# EAGLE design 1001-B Clone (EAGLE 6.3)
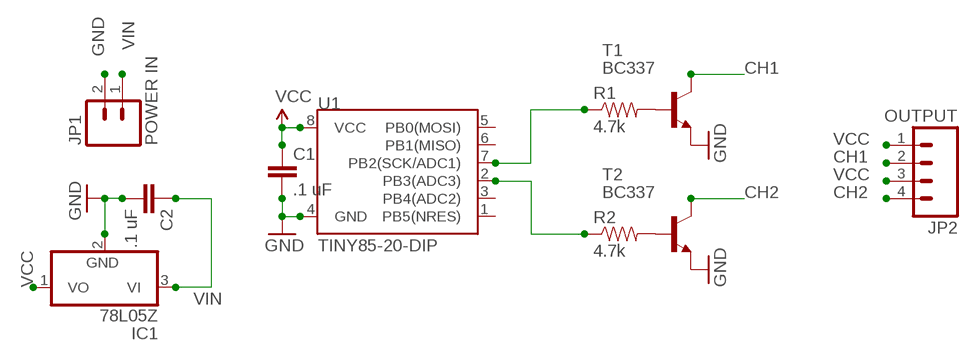
[diagram p0: schematic, sheet 1]

## Parts
C1  .1 uF  CAP1206  [1206]
C2  .1 uF  CAP1206  [1206]
IC1  78L05Z  [TO92]
JP1  POWER IN  M023.5MM  [SCREWTERMINAL-3.5MM-2]
JP2  OUTPUT  M04SCREW  [SCREWTERMINAL-3.5MM-4]
R1  4.7k  RESISTOR1206  [1206]
R2  4.7k  RESISTOR1206  [1206]
T1  BC337  [TO92]
T2  BC337  [TO92]
U1  TINY85-20-DIP  ATTINY45TINY85-20-DIP  [DIP08]

## Nets
CH1: JP2.2 T1.3(C)
CH2: JP2.4 T2.3(C)
GND: C1.2 C2.2 IC1.2(GND) JP1.2 T1.1(E) T2.1(E) U1.4(GND)
N$3: R1.2 T1.2(B)
N$4: R2.2 T2.2(B)
N$5: R1.1 U1.7(PB2(SCK/ADC1))
N$6: R2.1 U1.2(PB3(ADC3))
VCC: C1.1 IC1.1(VO) JP2.1 JP2.3 U1.8(VCC)
VIN: C2.1 IC1.3(VI) JP1.1
Unconnected: U1.1(PB5(NRES)) U1.3(PB4(ADC2)) U1.5(PB0(MOSI)) U1.6(PB1(MISO))

## Library data of the parts
C1 C2 = SparkFun-Capacitors:CAP: Capacitor Standard 0603 ceramic capacitor, and 0.1" leaded capacitor.
IC1 = linear:78*: Positive VOLTAGE REGULATOR Source: http://cache.national.com/ds/LM/LM78L05.pdf http://www.fairchildsemi.com/ds/LM/LM7805.pdf
JP1 = SparkFun-Connectors:M02: Header 2 Standard 2-pin 0.1" header. Use with straight break away headers (SKU : PRT-00116), right angle break away headers (PRT-00553), swiss pins (PRT-00743), machine pins (PRT-00117), and female headers (PRT-00115). Molex polarized connector foot print use with SKU : PRT-08233 with associated crimp pins and housings.
JP2 = SparkFun-Connectors:M04: Header 4 Standard 4-pin 0.1" header. Use with straight break away headers (SKU : PRT-00116), right angle break away headers (PRT-00553), swiss pins (PRT-00743), machine pins (PRT-00117), and female headers (PRT-00115). Molex polarized connector foot print use with SKU : PRT-08231 with associated crimp pins and housings. 1MM SMD Version SKU: PRT-10208
R1 R2 = SparkFun-Resistors:RESISTOR: Resistor Basic schematic elements and footprints for 0603, 1206, and PTH resistors.
T1 T2 = transistor:BC337: NPN TRANSISTOR
U1 = SparkFun-DigitalIC:ATTINY45: Atmel 8-pin 2/4/8kB flash uC; PROD_ID: IC-09445

## Board
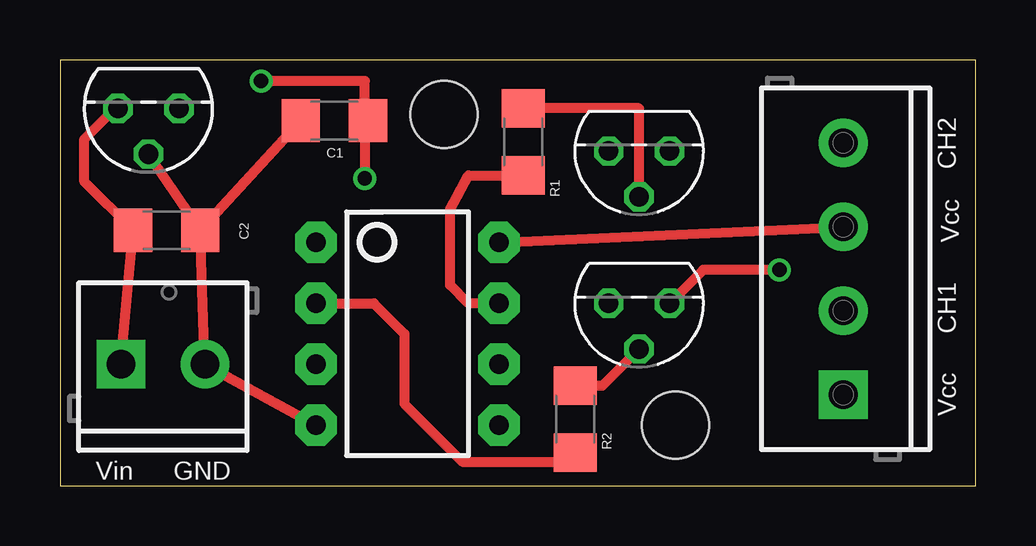
[diagram p1: board, top side]
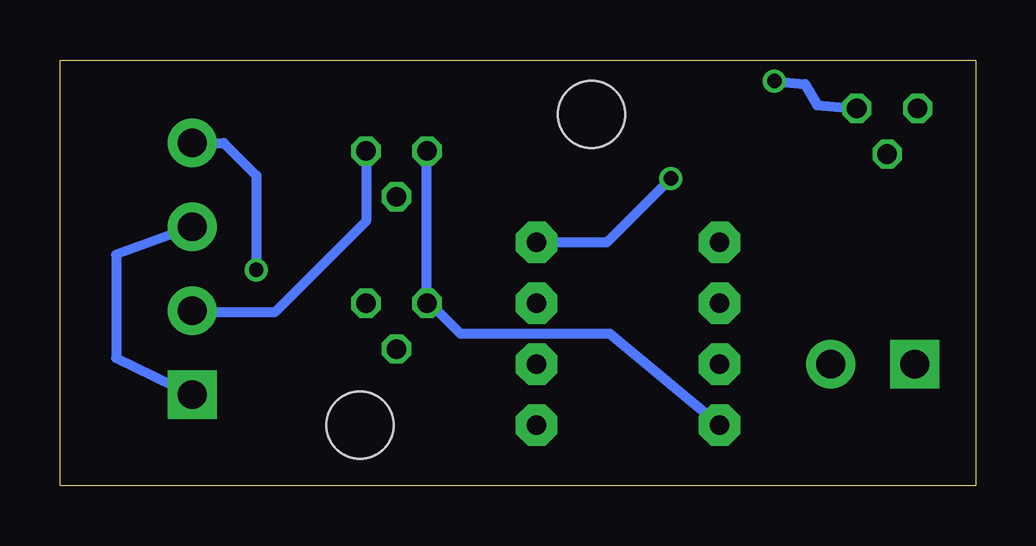
[diagram p2: board, bottom side, seen from below]

Size 38.15 x 17.77 mm. Coordinates in mm from the lower left corner, seen from the top.
Outline: 0,0 38.15,0 38.15,17.77 0,17.77 0,0
Copper layers (1*16): Top 0.0356mm / dielectric 1.5011mm / Bottom 0.0356mm
Design rules "LaenPCBOrder": minimum track width 6mil, minimum drill 13mil, track to track 6mil, track to pad 6mil, pad to pad 6mil, via to via 6mil, smd to smd 6mil, copper to edge 15mil, drill to drill 6mil, minimum pad ring 7mil, minimum via ring 7mil, stop-mask expansion 4mil, vias tented up to drill 0mil, thermal gap 10mil
Holes 2.8 mm at 16,15.49 25.65,2.54

### Footprints (pad centres in the part's own frame; a part is rotated, then mirrored left to right if it is on the bottom)
1206 = smd 1.6 x 1.8: 1 -1.4,0; 2 1.4,0
TO92 = drill 0.813 octagon: 1 -1.27,0; 2 0,1.905; 3 1.27,0
SCREWTERMINAL-3.5MM-2 = drill 1.2 pad 2.032 square: 1 0,0 | drill 1.2 pad 2.032: 2 3.5,0
SCREWTERMINAL-3.5MM-4 = drill 1.2 pad 2.032 square: 1 0,0 | drill 1.2 pad 2.032: 2 3.5,0; 3 7,0; 4 10.5,0
TO92' = drill 0.813 octagon: 1 1.27,0; 2 0,1.905; 3 -1.27,0
DIP08 = drill 0.813 pad 1.727 octagon: 1 -3.81,-3.81; 2 -1.27,-3.81; 3 1.27,-3.81; 4 3.81,-3.81; 5 3.81,3.81; 6 1.27,3.81; 7 -1.27,3.81; 8 -3.81,3.81

### Placement (x,y rotation side)
C1  11.43,15.24 180 top
C2  4.45,10.67 0 top
IC1  3.68,15.75 180 top
JP1  2.54,5.08 0 top
JP2  32.64,3.81 90 top
R1  19.3,14.35 90 top
R2  21.46,2.79 90 top
T1  BC337  [TO92']  24.13,13.97 180 top
T2  BC337  [TO92']  24.13,7.62 180 top
U1  14.48,6.35 270 top

### Tracks (layer width: path | path; a pad name or v marks a point on that pad's centre or on a via)
CH1
  Bottom 0.406: T1.3 25.4,11.05 29.21,7.24 32.57,7.24 JP2.2
CH2  (via drill 0.6)
  Top 0.406: v29.97,9.02 26.8,9.02 T2.3
  Bottom 0.406: JP2.4 31.33,14.31 29.97,12.95 v29.97,9.02
GND
  Top 0.406: C2.2 IC1.2 | C2.2 JP1.2 U1.4 | C2.2 C1.2
  Bottom 0.406: U1.4 15.24,6.35 21.46,6.35 22.73,7.62 T2.1 T1.1
N$3
  Top 0.406: T1.2 24.13,15.75 R1.2
N$4
  Top 0.406: R2.2 22.61,4.19 T2.2
N$5
  Top 0.406: U1.7 17.02,7.62 16.26,8.38 16.26,11.56 17.02,12.95 R1.1
N$6
  Top 0.406: U1.2 13.08,7.62 14.35,6.35 14.35,3.43 16.76,1.02 21.09,1.02 R2.1
VCC  (via drill 0.6)
  Top 0.406: v8.38,16.89 12.7,16.89 12.7,15.37 C1.1 12.7,15.11 v12.7,12.83 | U1.8 JP2.3
  Bottom 0.406: v8.38,16.89 7.11,16.76 6.6,15.88 IC1.1 | v12.7,12.83 15.37,10.16 U1.8 | JP2.3 35.81,9.65 35.81,5.33 JP2.1
VIN
  Top 0.406: JP1.1 C2.1 1.02,12.7 1.02,14.48 2.29,15.75 IC1.3

### Text on the board
tPlace: CH2 | Vcc | CH1 | Vcc | Vin | GND